# Altium schematic sheet SD Card_WCN_RF.SchDoc
size A0
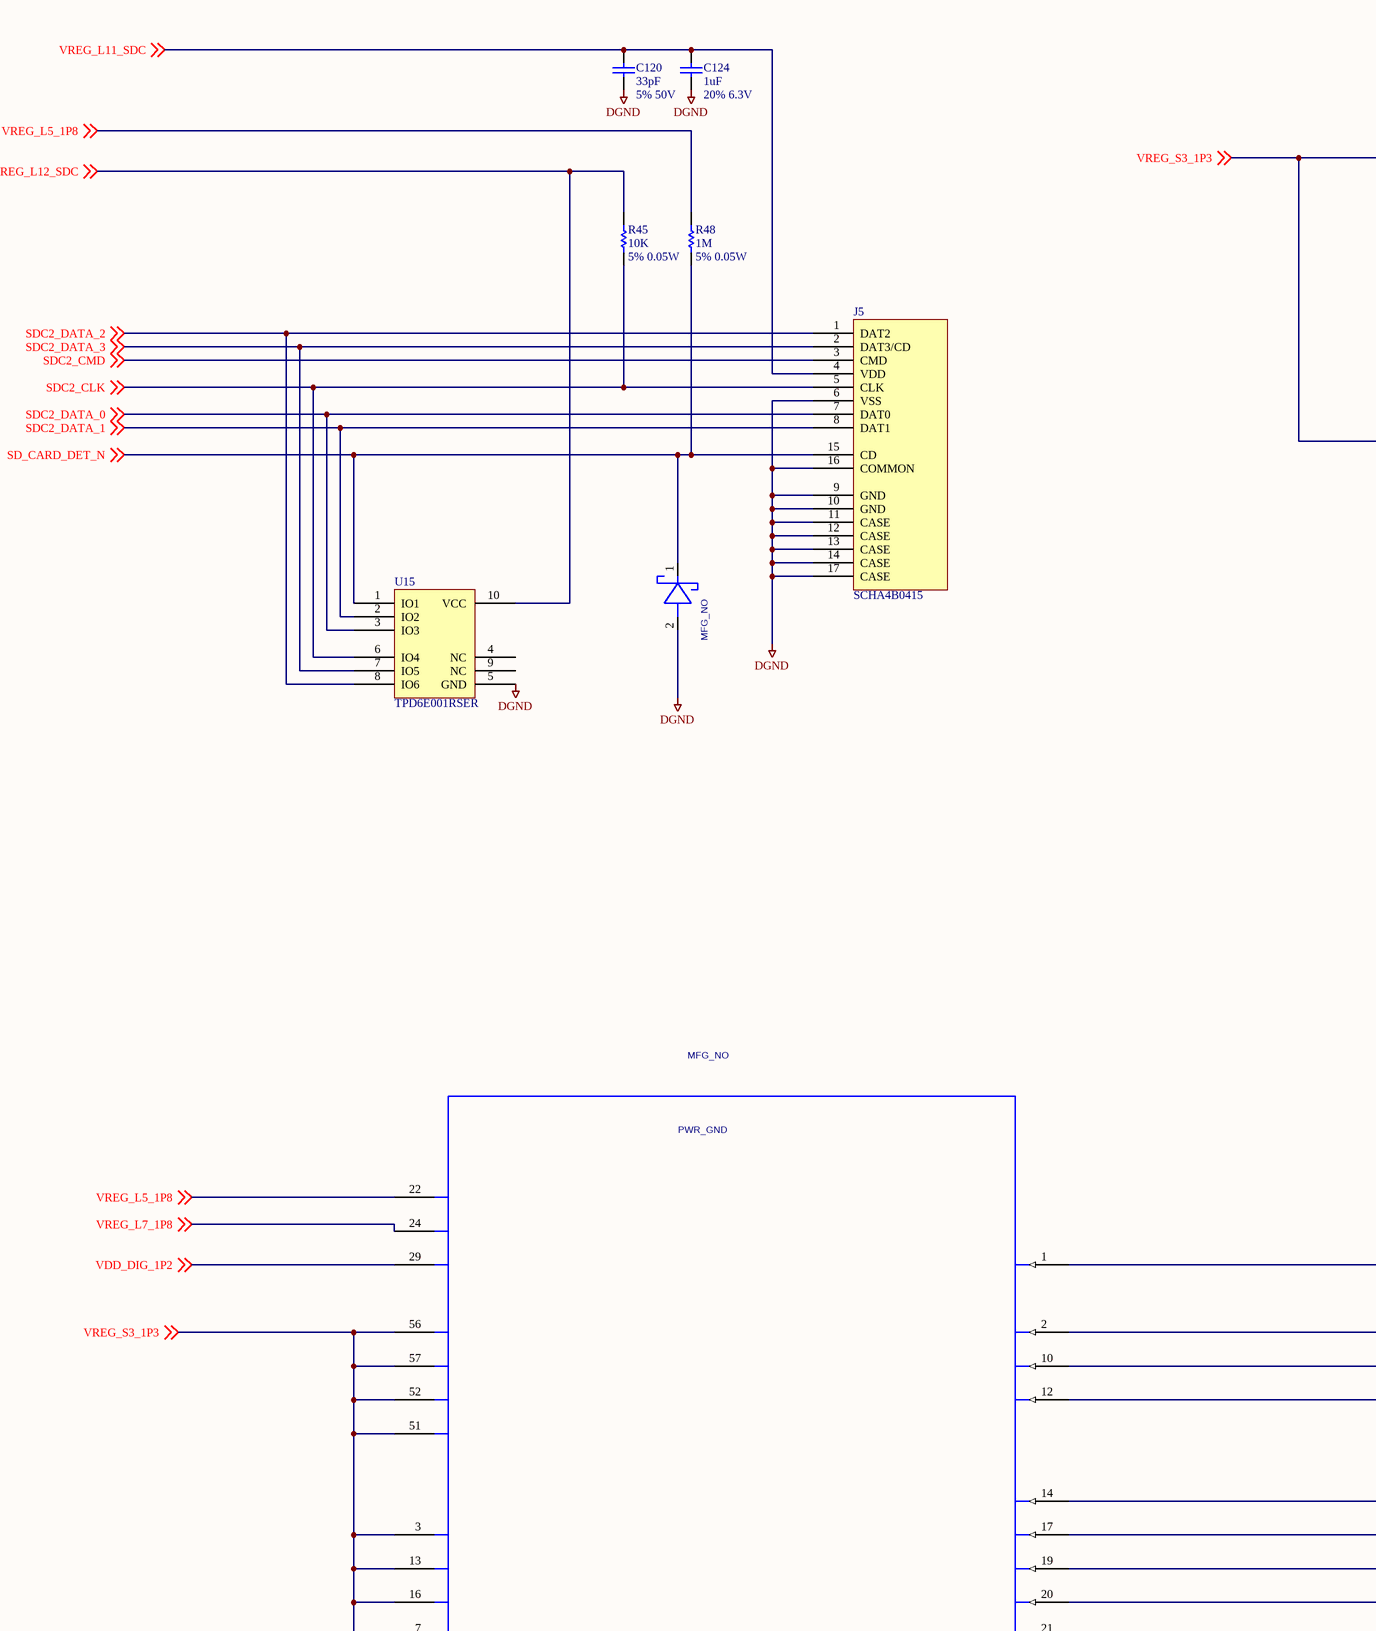
[diagram p0: SD Card_WCN_RF.SchDoc, top left]
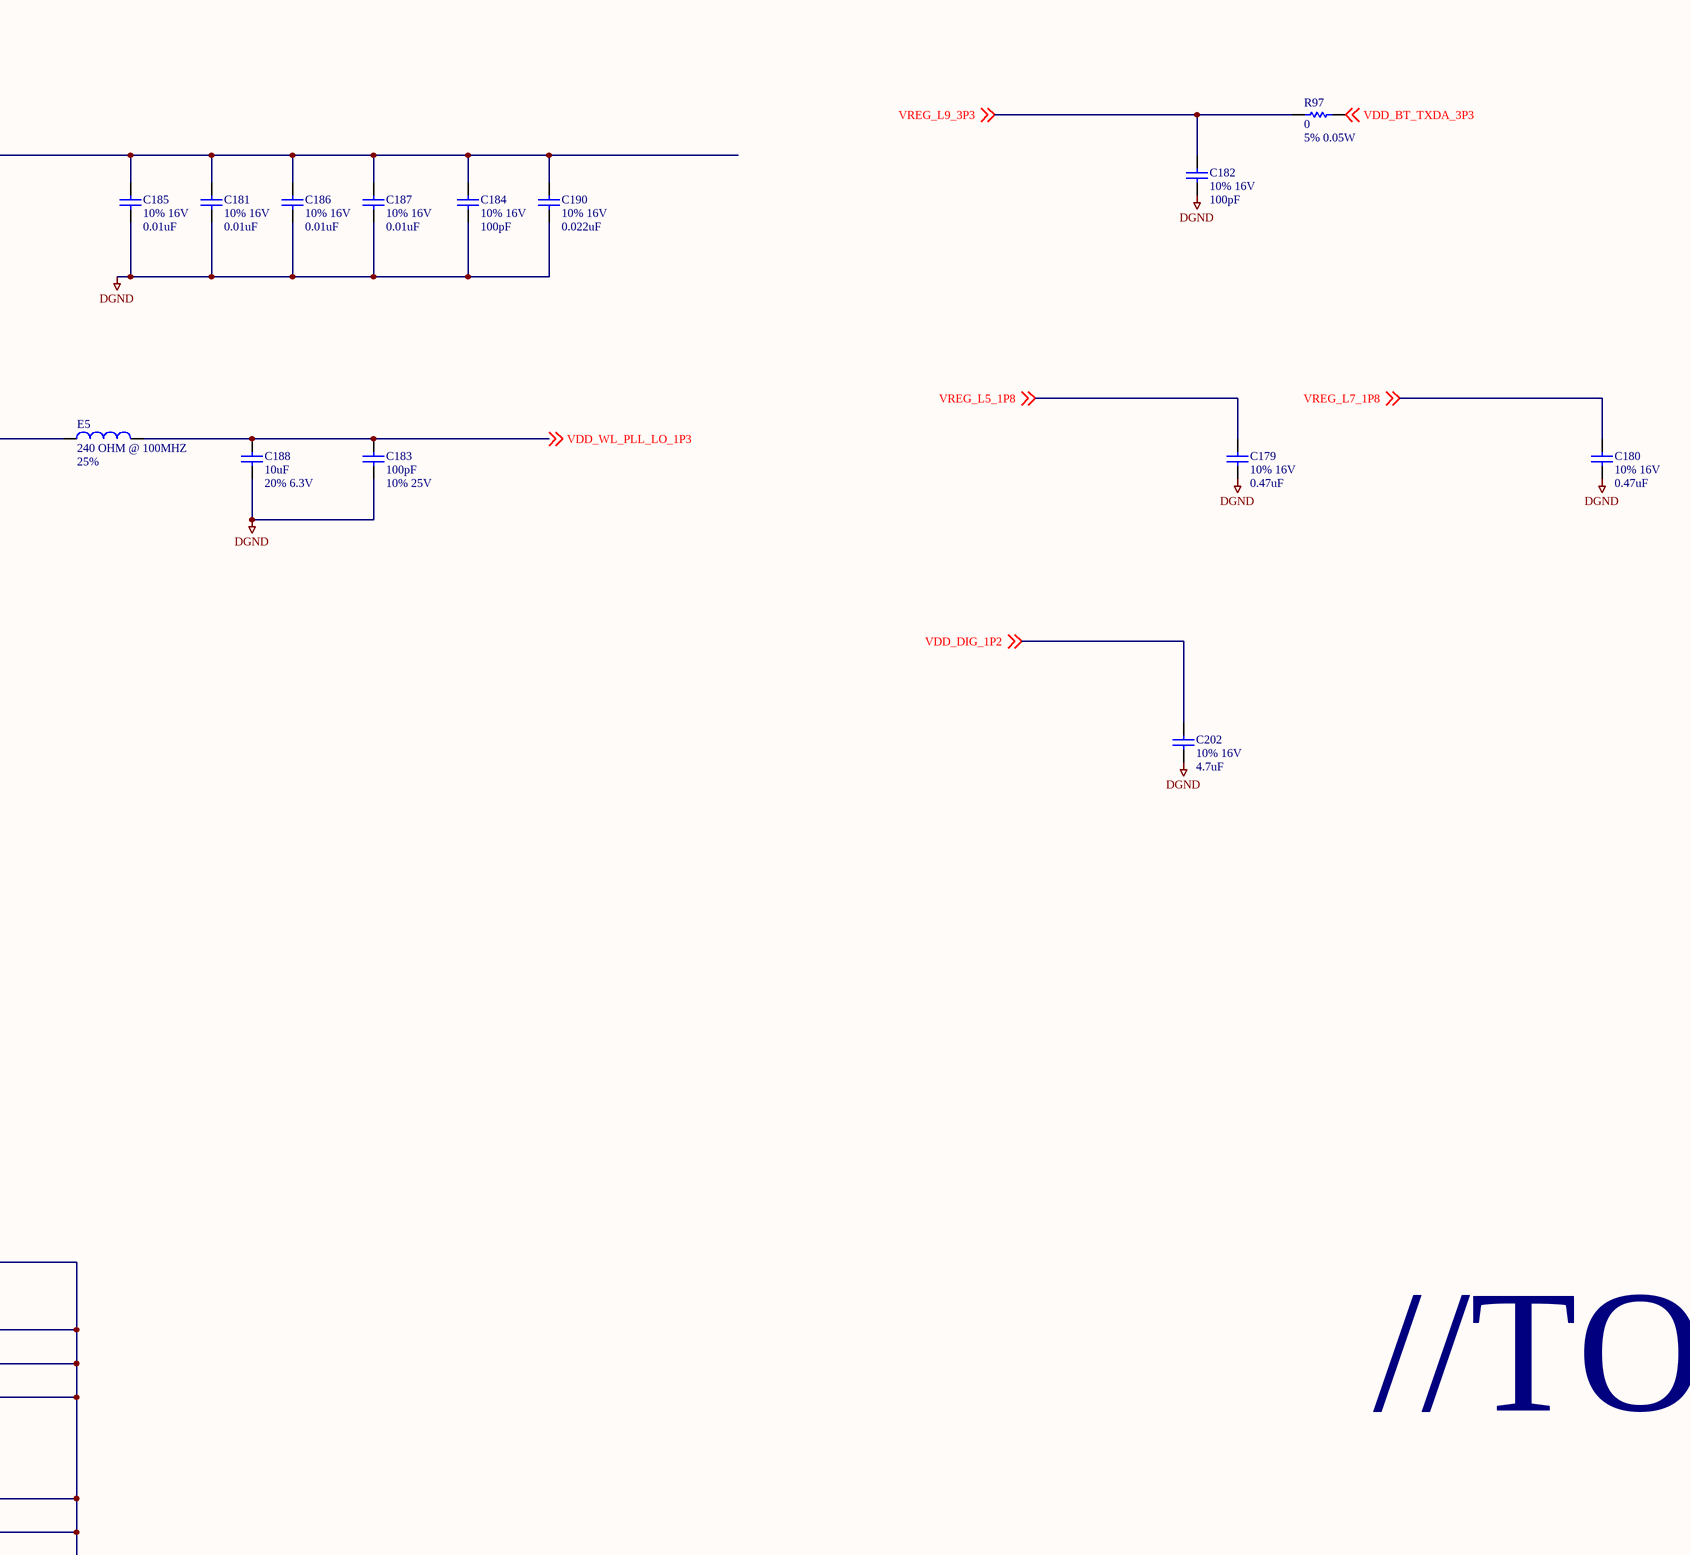
[diagram p1: SD Card_WCN_RF.SchDoc, top middle]
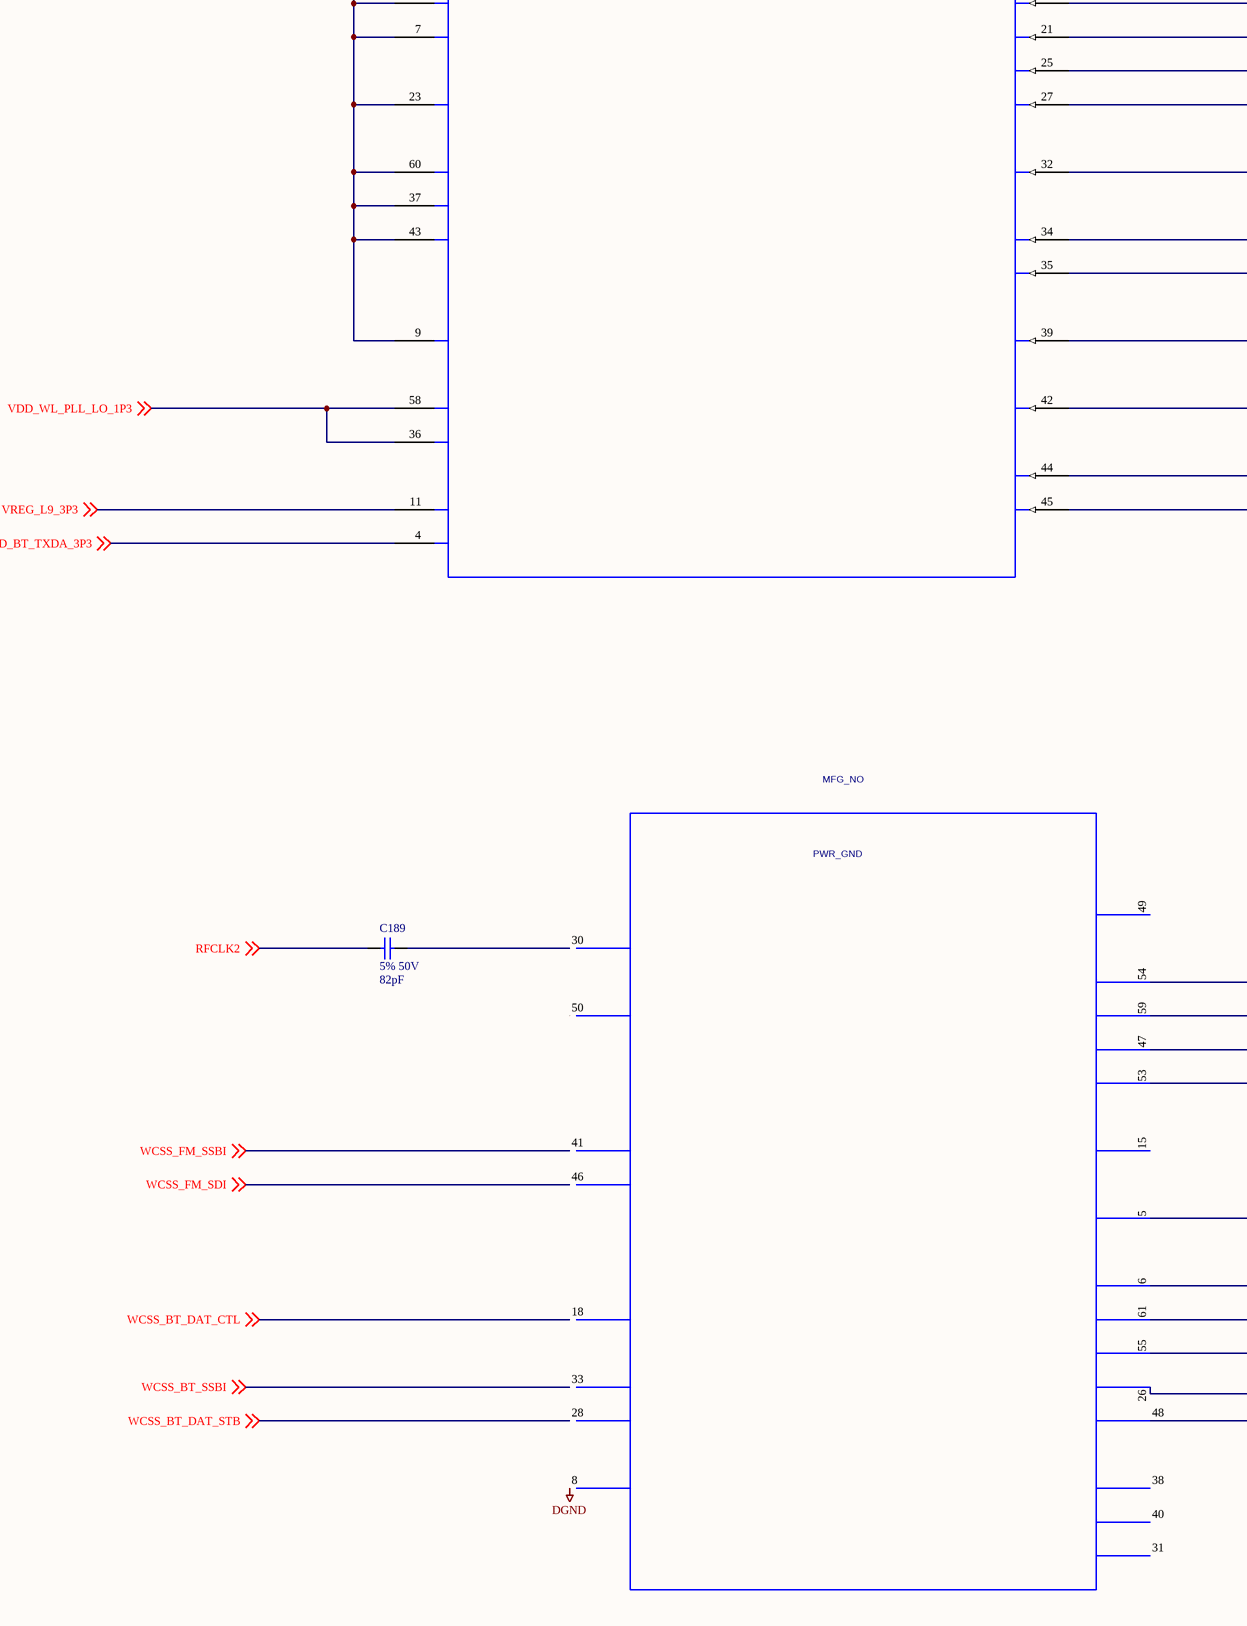
[diagram p2: SD Card_WCN_RF.SchDoc, bottom left]
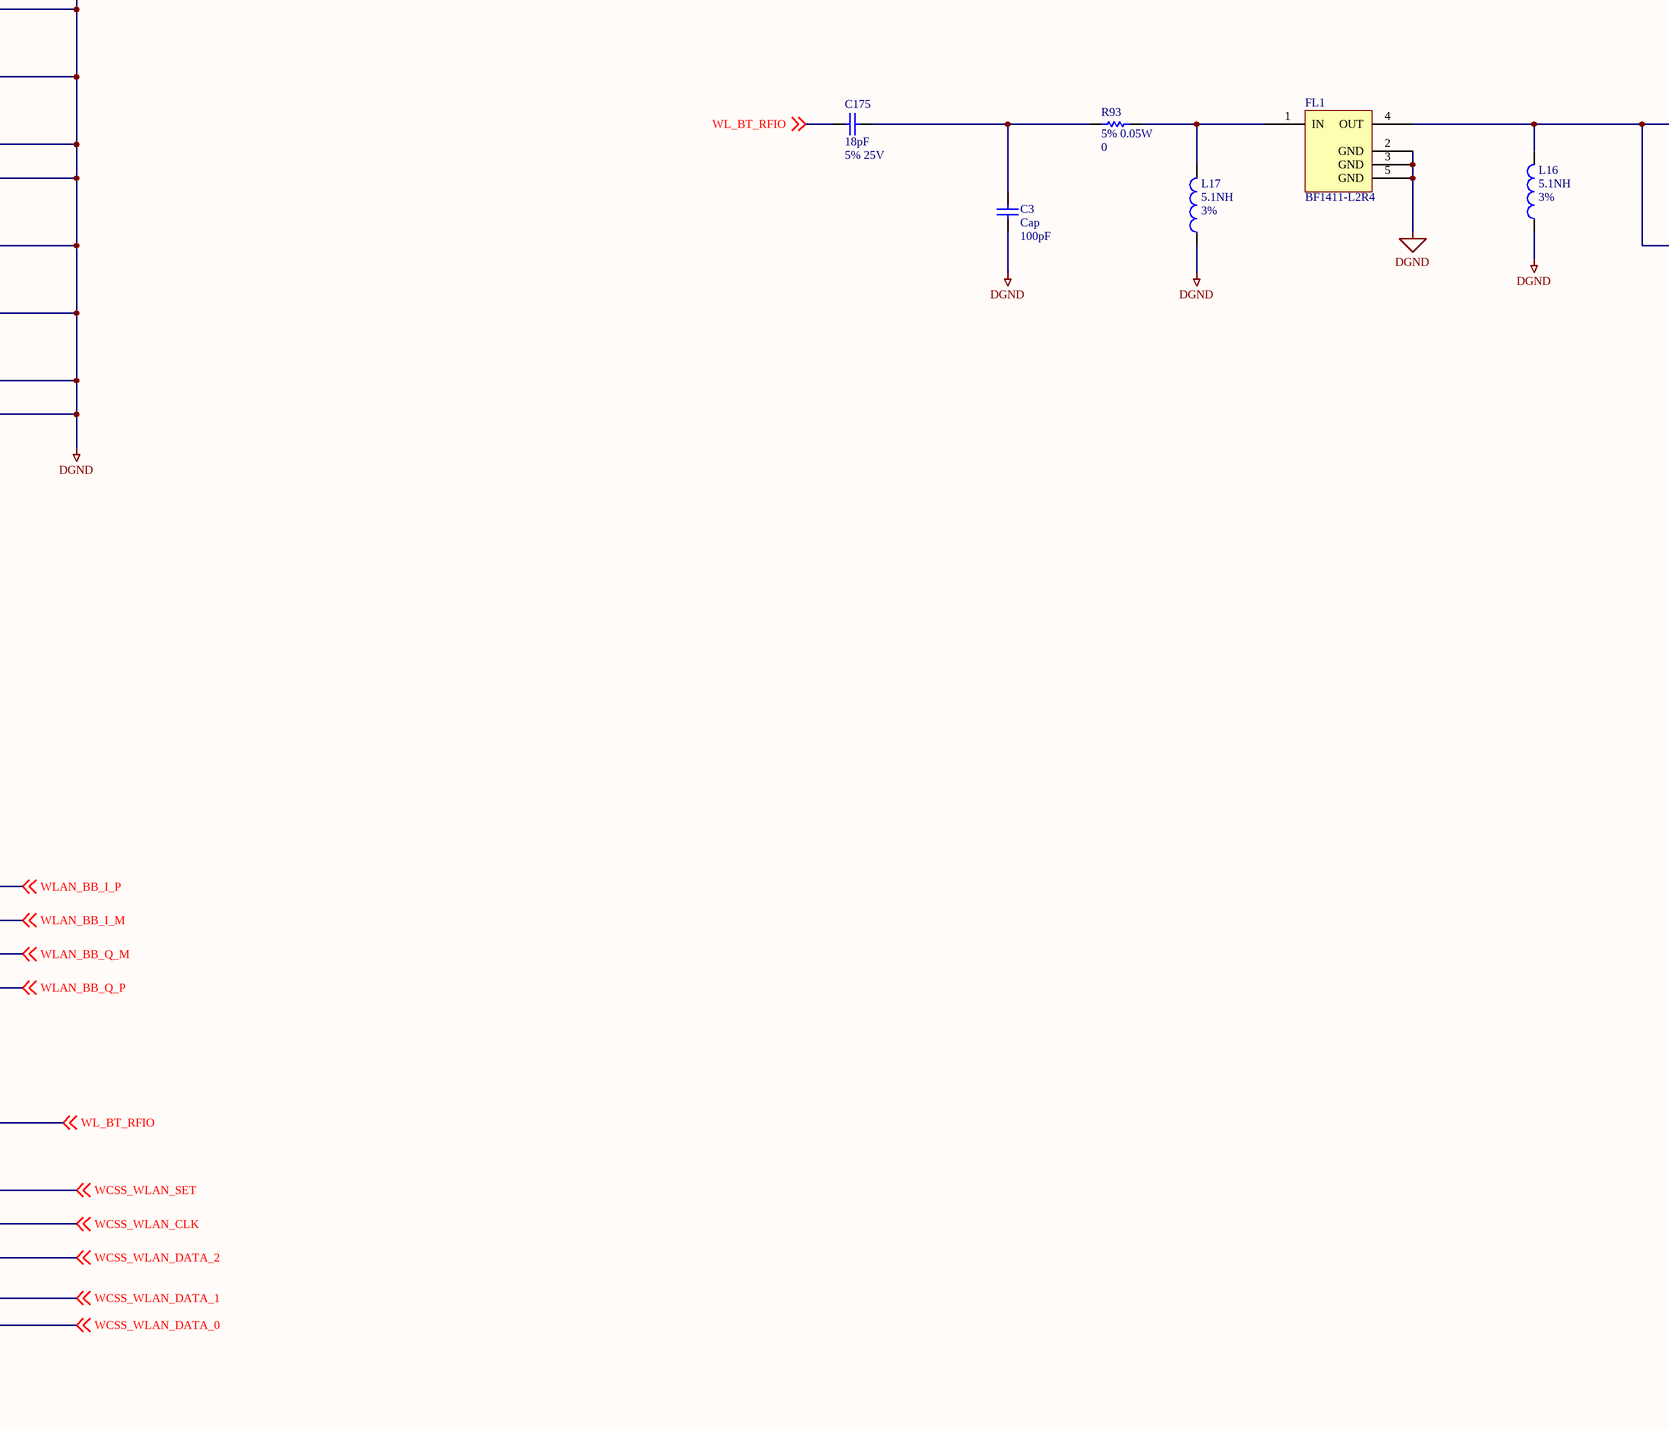
[diagram p3: SD Card_WCN_RF.SchDoc, bottom middle]
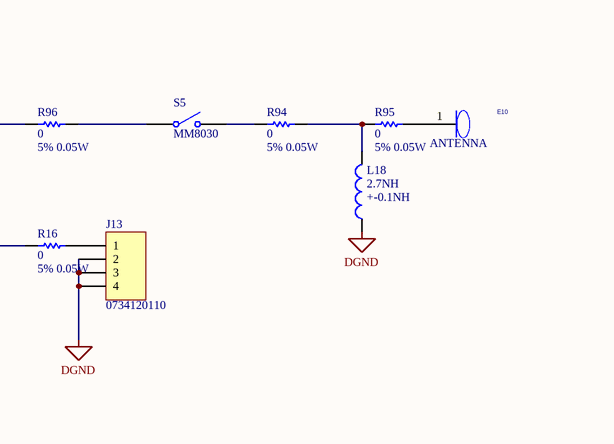
[diagram p4: SD Card_WCN_RF.SchDoc, bottom right]

## Parts
C3  Cap  value 100pF  [RAD-0.3]
C120  33pF  value 5% 50V  [C0402]
C124  1uF  value 20% 6.3V  [C0402]
C175  18pF  value 5% 25V  [RAD-0.3]
C179  10% 16V  value 0.47uF  [C0402]
C180  10% 16V  value 0.47uF  [C0402]
C181  10% 16V  value 0.01uF  [C0402]
C182  10% 16V  value 100pF  [C0402]
C183  100pF  value 10% 25V  [C0402]
C184  10% 16V  value 100pF  [C0402]
C185  10% 16V  value 0.01uF  [C0402]
C186  10% 16V  value 0.01uF  [C0402]
C187  10% 16V  value 0.01uF  [C0402]
C188  10uF  value 20% 6.3V  [C0402]
C189  5% 50V  value 82pF  [C0402]
C190  10% 16V  value 0.022uF  [C0402]
C202  10% 16V  value 4.7uF  [C0402]
CR24  PART_ID: MFG_NO  [c0402]  (hidden comment: ESD7C5)
E5  240 OHM @ 100MHZ  value 25%  [0402-A]
E10  ANTENNA  [TP]
FL1  BF1411-L2R4
J5  SCHA4B0415  [c0402]
J13  0734120110  [HDR1X4]
L16  5.1NH  value 3%  [0402-A]
L17  5.1NH  value 3%  [0402-A]
L18  2.7NH  value +-0.1NH  [0402-A]
R16  0  value 5% 0.05W  [AXIAL-0.3]
R45  10K  value 5% 0.05W  [r0402]
R48  1M  value 5% 0.05W  [r0402]
R93  5% 0.05W  value 0  [AXIAL-0.3]
R94  0  value 5% 0.05W  [AXIAL-0.3]
R95  0  value 5% 0.05W  [AXIAL-0.3]
R96  0  value 5% 0.05W  [AXIAL-0.3]
R97  0  value 5% 0.05W  [r0402]
S5  MM8030  [SPST-2]
U9  SYMNAME: PWR_GND  PART_ID: MFG_NO  [WCN-3620-0-61WLNSP-TR-05-0]  (hidden comment: ASIC_WCN3620_80_WL006_1)  (parts A,B of 2)
U15  TPD6E001RSER  [c0402]

## Nets
DGND: C3.1 C120.1 C124.1 C179.1 C180.1 C181.1 C182.1 C183.1 C184.1 C185.1 C186.1 C187.1 C188.1 C190.1 C202.1 CR24.2(POS) FL1.2(GND) FL1.3(GND) FL1.5(GND) J5.6(VSS) J5.9(GND) J5.10(GND) J5.11(CASE) J5.12(CASE) J5.13(CASE) J5.14(CASE) J5.16(COMMON) J5.17(CASE) J13.2 J13.3 J13.4 L16.1 L17.1 L18.1 U9.1(GND2) U9.2(GND3) U9.8(GND1) U9.10(GND4) U9.12(GND5) U9.14(GND6) U9.17(GND7) U9.19(GND8) U9.20(GND9) U9.21(GND10) U9.25(GND11) U9.27(GND12) U9.32(GND13) U9.34(GND14) U9.35(GND15) U9.39(GND16) U9.42(GND17) U9.44(GND18) U9.45(GND19) U15.5(GND)
RFCLK2: C189.2 ; off-sheet RFCLK2
SD_CARD_DET_N: CR24.1(NEG) J5.15(CD) R48.1 U15.1(IO1) ; off-sheet SD_CARD_DET_N
SDC2_CLK: J5.5(CLK) R45.1 U15.6(IO4) ; off-sheet SDC2_CLK
SDC2_CMD: J5.3(CMD) ; off-sheet SDC2_CMD
SDC2_DATA_0: J5.7(DAT0) U15.3(IO3) ; off-sheet SDC2_DATA_0
SDC2_DATA_1: J5.8(DAT1) U15.2(IO2) ; off-sheet SDC2_DATA_1
SDC2_DATA_2: J5.1(DAT2) U15.8(IO6) ; off-sheet SDC2_DATA_2
SDC2_DATA_3: J5.2(DAT3/CD) U15.7(IO5) ; off-sheet SDC2_DATA_3
VDD_BT_TXDA_3P3: R97.2 U9.4(VDD_BT_DA_3P0) ; off-sheet VDD_BT_TXDA_3P3
VDD_DIG_1P2: C202.2 U9.29(VDD_DIG_1P2) ; off-sheet VDD_DIG_1P2
VDD_WL_PLL_LO_1P3: C183.2 C188.2 E5.2 U9.36(VDD_WL_LO_1P3) U9.58(VDD_WL_PLL_1P3) ; off-sheet VDD_WL_PLL_LO_1P3
VREG_L5_1P8: C179.2 R48.2 U9.22(VDD_IO_1P8) ; off-sheet VREG_L5_1P8
VREG_L7_1P8: C180.2 U9.24(VDD_XO_1P8) ; off-sheet VREG_L7_1P8
VREG_L9_3P3: C182.2 R97.1 U9.11(VDD_WL_2GPA_3P0) ; off-sheet VREG_L9_3P3
VREG_L11_SDC: C120.2 C124.2 J5.4(VDD) ; off-sheet VREG_L11_SDC
VREG_L12_SDC: R45.2 U15.10(VCC) ; off-sheet VREG_L12_SDC
VREG_S3_1P3: C181.2 C184.2 C185.2 C186.2 C187.2 C190.2 E5.1 U9.3(VDD_BT_RF_1P3) U9.7(VDD_BT_VCO_1P3) U9.9(VDD_WL_2GLNA_1P3) U9.13(VDD_BT_BB_1P3) U9.16(VDD_BT_PLL_1P3) U9.23(VDD_BT_FM_DIG_1P3) U9.37(VDD_WL_2GPA_1P3) U9.43(VDD_WL_UPC_1P3) U9.51(VDD_FM_VCO_1P3) U9.52(VDD_FM_PLL_1P3) U9.56(VDD_FM_RXFE_1P3) U9.57(VDD_FM_RXBB_1P3) U9.60(VDD_WL_BB_1P3) ; off-sheet VREG_S3_1P3
WCSS_BT_DAT_CTL: U9.18(BT_CTL) ; off-sheet WCSS_BT_DAT_CTL
WCSS_BT_DAT_STB: U9.28(BT_DATA) ; off-sheet WCSS_BT_DAT_STB
WCSS_BT_SSBI: U9.33(BT_SSBI) ; off-sheet WCSS_BT_SSBI
WCSS_FM_SDI: U9.46(FM_DATA) ; off-sheet WCSS_FM_SDI
WCSS_FM_SSBI: U9.41(FM_SSBI) ; off-sheet WCSS_FM_SSBI
WCSS_WLAN_CLK: U9.61(WL_CMD_CLK) ; off-sheet WCSS_WLAN_CLK
WCSS_WLAN_DATA_0: U9.48(WL_CMD_DATA0) ; off-sheet WCSS_WLAN_DATA_0
WCSS_WLAN_DATA_1: U9.26(WL_CMD_DATA1) ; off-sheet WCSS_WLAN_DATA_1
WCSS_WLAN_DATA_2: U9.55(WL_CMD_DATA2) ; off-sheet WCSS_WLAN_DATA_2
WCSS_WLAN_SET: U9.6(WL_CMD_SET) ; off-sheet WCSS_WLAN_SET
WL_BT_RFIO: C175.1 U9.5(WL_BT_RFIO) ; off-sheet WL_BT_RFIO
WLAN_BB_I_M: U9.59(WL_BB_IN) ; off-sheet WLAN_BB_I_M
WLAN_BB_I_P: U9.54(WL_BB_IP) ; off-sheet WLAN_BB_I_P
WLAN_BB_Q_M: U9.47(WL_BB_QN) ; off-sheet WLAN_BB_Q_M
WLAN_BB_Q_P: U9.53(WL_BB_QP) ; off-sheet WLAN_BB_Q_P
NetC3_2: C3.2 C175.2 R93.1
NetC189_1: C189.1 U9.30(TCXO_IN)
NetE10_1: E10.1 R95.2
NetFL1_1: FL1.1(IN) L17.2 R93.2
NetFL1_4: FL1.4(OUT) L16.2 R16.1 R96.1
NetJ13_1: J13.1 R16.2
NetL18_2: L18.2 R94.2 R95.1
NetR94_1: R94.1 S5.2(NO)
NetR96_2: R96.2 S5.1(COMMON)

Not connected (* = marked no-connect by the designer): U9 15(NC1) 31(NC2) 38(NC4) 40(NC3) 49(WL_PDET_IN) 50(FM_HS_RX); U15 4(NC) 9(NC)

## Notes on the sheet
- //TODO ANTENNA HERE

## Library data of the parts
C3 C120 C124 C175 C179-C190 C202 = Cap: Capacitor; Published: 8-Jun-2000; LatestRevisionDate: 17-Jul-2002; LatestRevisionNote: Re-released for DXP Platform.; PackageReference: RAD-0.3; Publisher: Altium Limited; PackageDescription: Radial Cap, Thru-Hole; 2 Leads; 0.3 in Pin Spacing
CR24 = SCHOTTKY: PART_NUMBER: MCN_NO; OriginalSymbolOrigin: (-100,100); CDS_LMAN_SYM_OUTLINE: -50,75,50,-75; SYMNAME: SCHOTTKY; PACK_TYPE: ?
E5 L16-L18 = Inductor: Code_IEC: 1005; Published: 8-Jun-2000; LatestRevisionDate: 29-May-2009; LatestRevisionNote: IPC-7351 Footprint Added.; PackageReference: 0402-A; Publisher: Altium Limited; PackageDescription: Chip Inductor; Code_JEITA: 0402
E10 = TP
J13 = Header 4: Header, 4-Pin; LatestRevisionDate: 17-Jul-2002; LatestRevisionNote: Re-released for DXP Platform.; Publisher: Altium Limited
R16 R45 R48 R93-R97 = Res1: Resistor; Published: 8-Jun-2000; LatestRevisionDate: 17-Jul-2002; LatestRevisionNote: Re-released for DXP Platform.; PackageReference: AXIAL-0.3; Publisher: Altium Limited; PackageDescription: Axial Device, Thru-Hole; 2 Leads; 0.3 in Pin Spacing
S5 = SW-SPST: Single-Pole, Single-Throw Switch; Published: 24-Mar-1999; LatestRevisionDate: 17-Jul-2002; LatestRevisionNote: Re-released for DXP Platform.; PackageReference: SPST-2; Publisher: Altium Limited; PackageDescription: Switch; 2 Leads
U9 = ASIC_WCN3620_80_WL006_1: PART_NUMBER: MCN_NO; OriginalSymbolOrigin: (-1075,1375); SPLIT_INST: TRUE; CDS_LMAN_SYM_OUTLINE: -850,1375,875,-1500; CDS_LMAN_SPLIT_NUMBER: 1 of 2; PACK_TYPE: ?